# Altium schematic sheet Esq_Interconexion.SchDoc: Esquema de Interconexion
size A4; Date: 04/2014; Author: Roux, Federico G.; CompanyName: Universidad Favaloro; DrawnBy: Roux, Federico G.; Engineer: Dr. Craiem, Damian; Organization: Universidad Favaloro; DocumentName: Esq_Interconexion.SchDoc; ProjectName: Acondicionamiento_Presion
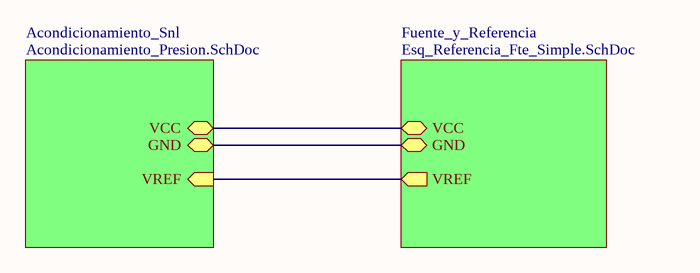
[diagram p0: Esq_Interconexion.SchDoc]

## Sub-sheets
Acondicionamiento_Snl = Acondicionamiento_Presion.SchDoc: VCC, GND, VREF (in)
Fuente_y_Referencia = Esq_Referencia_Fte_Simple.SchDoc: VCC, GND, VREF (out)

## Nets
(unnamed): sheet Acondicionamiento_Snl/VCC, sheet Fuente_y_Referencia/VCC
(unnamed): sheet Acondicionamiento_Snl/GND, sheet Fuente_y_Referencia/GND
(unnamed): sheet Acondicionamiento_Snl/VREF, sheet Fuente_y_Referencia/VREF